# Altium schematic sheet CAN.SchDoc
size A
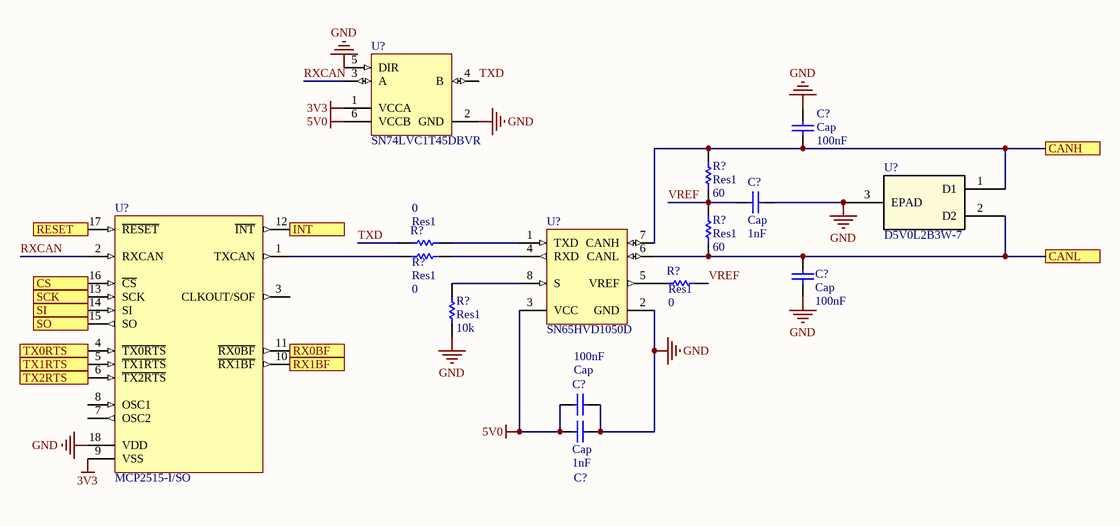
[diagram p0: CAN.SchDoc]

## Parts
(Parts that share a designator on the sheet are numbered #1, #2 ... from top to bottom, then left to right.)
C?#1  Cap  value 100nF  [RAD-0.3]
C?#2  Cap  value 1nF  [RAD-0.3]
C?#3  Cap  value 100nF  [RAD-0.3]
C?#4  Cap  value 100nF  [RAD-0.3]
C?#5  Cap  value 1nF  [RAD-0.3]
R?#1  Res1  value 60  [AXIAL-0.3]
R?#2  Res1  value 0  [AXIAL-0.3]
R?#3  Res1  value 60  [AXIAL-0.3]
R?#4  Res1  value 0  [AXIAL-0.3]
R?#5  Res1  value 0  [AXIAL-0.3]
R?#6  Res1  value 10k  [AXIAL-0.3]
U?#1  SN74LVC1T45DBVR  [DBV0006A_L]
U?#2  D5V0L2B3W-7  [SOT-323_DIO]
U?#3  MCP2515-I/SO  [SOIC-SO18_L]
U?#4  SN65HVD1050D  [D0008A_N]

## Ports
CANH, CANL, CS, INT, RESET, RX0BF, RX1BF, SCK, SI, SO, TX0RTS, TX1RTS, TX2RTS

## Nets
3V3: U?#1.1(VCCA) U?#3.9(VSS)
5V0: C?#4.1 C?#5.2 U?#1.6(VCCB) U?#4.3(VCC)
GND: C?#1.1 C?#2.2 C?#3.1 C?#4.2 C?#5.1 R?#6.1 U?#1.2(GND) U?#1.5(DIR) U?#2.3(EPAD) U?#3.18(VDD) U?#4.2(GND)
CANH: C?#1.2 R?#1.1 U?#2.1(D1) U?#4.7(CANH) ; port CANH
CANL: C?#3.2 R?#3.1 U?#2.2(D2) U?#4.6(CANL) ; port CANL
CS: U?#3.16(~{CS}) ; port CS
INT: U?#3.12(~{INT}) ; port INT
RESET: U?#3.17(~{RESET}) ; port RESET
RX0BF: U?#3.11(~{RX0BF}) ; port RX0BF
RX1BF: U?#3.10(~{RX1BF}) ; port RX1BF
RXCAN: U?#1.3(A) U?#3.2(RXCAN)
SCK: U?#3.13(SCK) ; port SCK
SI: U?#3.14(SI) ; port SI
SO: U?#3.15(SO) ; port SO
TX0RTS: U?#3.4(~{TX0RTS}) ; port TX0RTS
TX1RTS: U?#3.5(~{TX1RTS}) ; port TX1RTS
TX2RTS: U?#3.6(~{TX2RTS}) ; port TX2RTS
TXD: R?#2.1 U?#1.4(B)
VREF: C?#2.1 R?#1.2 R?#3.2 R?#5.2
NetR?#2_2: R?#2.2 U?#4.1(TXD)
NetR?#4_1: R?#4.1 U?#4.4(RXD)
NetR?#4_2: R?#4.2 U?#3.1(TXCAN)
NetR?#5_1: R?#5.1 U?#4.5(VREF)
NetR?#6_2: R?#6.2 U?#4.8(S)

Not connected (* = marked no-connect by the designer): U?#3 3(CLKOUT/SOF) 7(OSC2) 8(OSC1)

## Library data of the parts
C?#1-C?#5 = Cap: Capacitor; Published: 8-Jun-2000; LatestRevisionDate: 17-Jul-2002; LatestRevisionNote: Re-released for DXP Platform.; PackageReference: RAD-0.3; Publisher: Altium Limited; PackageDescription: Radial Cap, Thru-Hole; 2 Leads; 0.3 in Pin Spacing
R?#1-R?#6 = Res1: Resistor; Published: 8-Jun-2000; LatestRevisionDate: 17-Jul-2002; LatestRevisionNote: Re-released for DXP Platform.; PackageReference: AXIAL-0.3; Publisher: Altium Limited; PackageDescription: Axial Device, Thru-Hole; 2 Leads; 0.3 in Pin Spacing
U?#1 = CMP-0859-00206-3: Single-Bit Dual-Supply Bus Transceiver with Configurable Voltage Translation and 3-State Outputs, DBV0006A, LARGE T&R; Manufacturer: Texas Instruments; VCC(Max)(V): 5.5; Input Type: CMOS/TTL; Technology Family: LVC; Voltage(Nom)(V): 1.8,2.5,3.3,5; ICC @ Nom Voltage(Max)(mA): 0.004; Bits(#): 1; F @ Nom Voltage(Max)(Mhz): 150; Output Drive (IOL/IOH)(Max)(mA): 32/-32; 3-State Output: Yes; Logic: True; Schmitt Trigger: No; Output Type: CMOS; Rating: Catalog; tpd @ Nom Voltage(Max)(ns): 15.5,8,5.8,4.4; VCC(Min)(V): 1.65; Sub-Family: Dual Supply Translator; Generic Part Number: SN74LVC1T45; PackageReference: DBV0006A; DatasheetVersion: SCES515K; Operating Temperature Range(C): -40 to 85
U?#2 = D5V0L2B3W-7: No Description Available; Vendor: Diodes Inc; Built_By: EMA_UL_Team; SourceLibrary: DIODESINC_2_2015-08-18; Manufacturer_Part_Number: D5V0L2B3W-7; Copyright: Copyright (C) 2018 Accelerated Designs. All rights reserved; RefDes: RefDes; Type: DEV
U?#3 = CMP-0186-00133-2: Stand-Alone CAN Controller With SPI Interface, 18-Pin SOIC, Industrial Temperature; ComponentLink2Description: Datasheet; RevisionNote: URLs added. DatasheetVersion updated.; PackageVersion: revBB, Aug-2009; ComponentLink1URL: http://www.microchip.com/; PackageReference: SOIC-SO18; PackageDescription: 18-Lead Plastic Small Outline (SO) - Wide 7.50mm Body [SOIC]; DatasheetVersion: revF, Oct-2010; ComponentLink2URL: http://ww1.microchip.com/downloads/en/DeviceDoc/21801f.pdf; ComponentLink3URL: http://www.microchip.com/stellent/groups/techpub_sg/documents/packagingspec/en012702.pdf; Code_JEDEC: MS-013; ComponentLink3Description: Package Specification; ComponentLink1Description: Manufacturer URL
U?#4 = CMP-0315-00048-2: High-Speed EMC Optimized CAN Transceiver, 70 mA, 5 V, -40 to 125 degC, 8-pin SOIC (D), Green (RoHS & no Sb/Br); Manufacturer: Texas Instruments; Bus Fault Voltage(V): -4 to 16; Rating: Catalog; Drivers Per Package: 1; Transient Pulse Protection(V): -200 to 200; ICC(Max)(mA): 70; Supply Voltage(s)(V): 5; PackageVersion: revM, Jun-2011; PartNumber: SN65HVD1050D; PackageReference: D0008A; Code_JEDEC: MS-012AA; Isolated: No; ComponentLink1Description: Datasheet; PackageDescription: 8-Pin Plastic Small Outline Integrated Circuit, 4.9 x 3.9 mm, Pitch 1.27 mm Pitch; Receivers Per Package: 1; Footprint: TJA1050; DatasheetVersion: SLLS632B; SubFamily: CAN; ComponentLink1URL: http://www.ti.com/general/docs/lit/getliterature.tsp?genericPartNumber=SN65HVD1050&fileType=pdf; Eco-Plan: Green (RoHS & no Sb/Br); Mounting Technology: Surface Mount